# EasyEDA schematic HABSat2_schematic2302.json
TITLE: HABSat2 Schematic; REV: 1.3; Date: 2023-02-23; Sheet: 1/1; Company: Cosmo PK
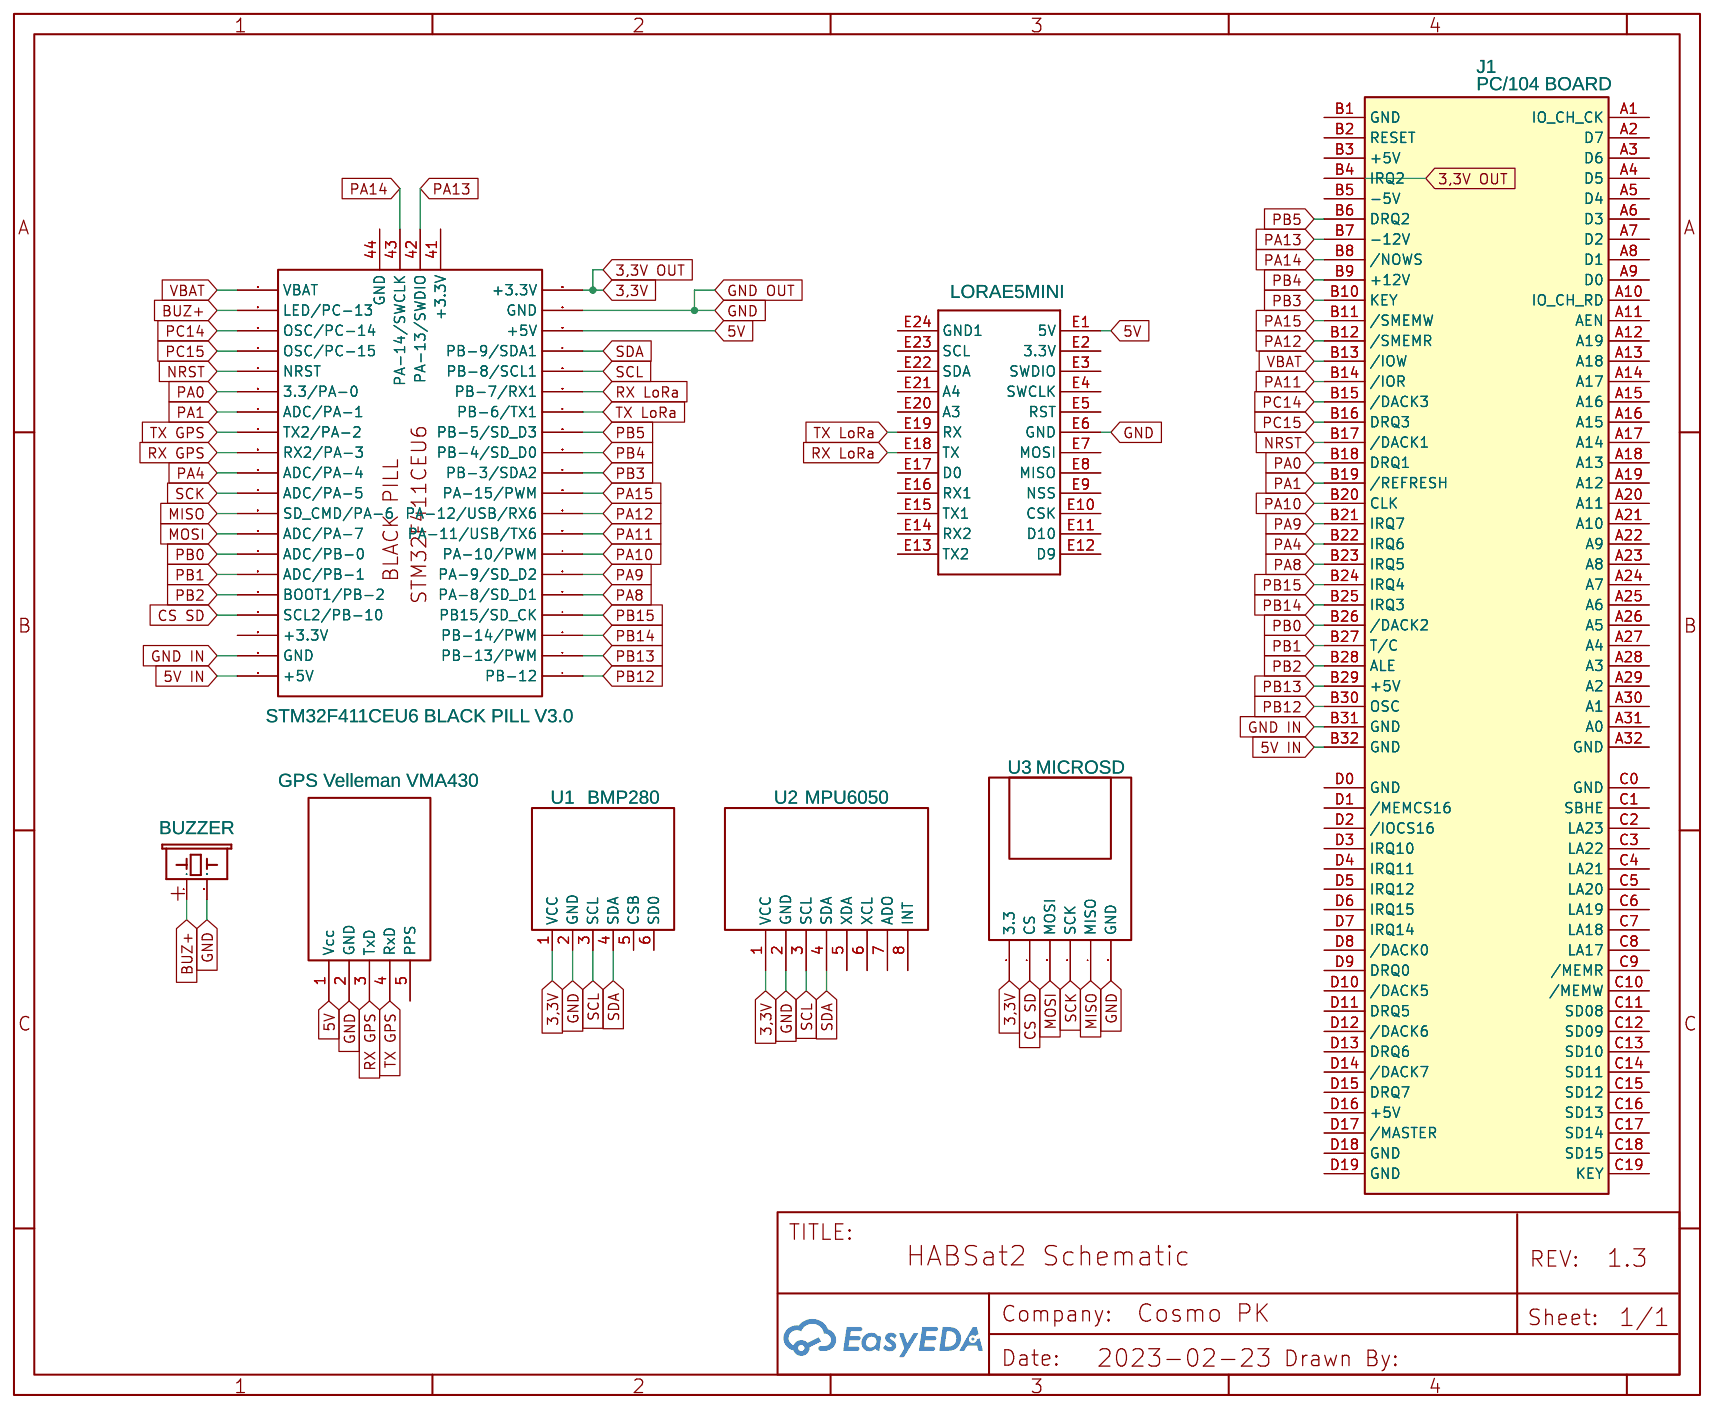
[diagram p0: schematic sheet]

## Parts
1  LORAE5MINI  [LORAE5MINI]
J1  PC/104 BOARD  [PC/104 BOARD]
SG1  BUZZER  [BUZZER-KPX-120X]
STM1  STM32F411CEU6 BLACK PILL V3.0  [STM32F411CEU6BP]
U1  BMP280  [GY-BMP280]
U2  MPU6050  [MPU6050]
U3  MICROSD  [MICROSDCARDADAPTER]
VCC  GPS Velleman VMA430  [GPS VELLEMAN VMA430]

## Library data of the parts
1 = LORAE5MINI: Contributor: Niranjoy Y
J1 = PC/104 BOARD: Contributor: andrey.shurmin
SG1 = BUZZER KX-12MM: Contributor: SparkFun; sourceId: Q1xPJ1Vd7
STM1 = STM32F411CEU6 BLACK PILL V3.0: Contributor: sulthon100399
U1 = GY-BMP280: Contributor: umitmehmet2000
U2 = MPU6050: Contributor: Bas Stoker
U3 = MICROSD: Contributor: appurva
VCC = GPS Velleman VMA430: Manufacturer: Velleman; Manufacturer Part: VMA430; Supplier: botland; Supplier Part: VMA430; link: https://botland.com.pl/moduly-gps/13032-velleman-vma430-modul-gps-glonass-u-blox-neo-7m-uart-z-antena-5410329680930.html; Contributor: szczuplak

## Nets
5V: 1.E1(5V) STM1.18(+5V) VCC.1(Vcc)
5V IN: J1.B32(GND) STM1.40(+5V)
GND: 1.E6(GND) SG1.2 STM1.19(GND) U1.2(GND) U2.2(GND) U3.6(GND) VCC.2(GND)
GND IN: J1.B31(GND) STM1.39(GND)
VBAT: J1.B13(/IOW) STM1.21(VBAT)
3,3V: J1.B4(IRQ2) STM1.20(+3.3V) U1.1(VCC) U2.1(VCC) U3.5(3.3)
BUZ+: SG1.1 STM1.22(LED/PC-13)
CS SD: STM1.37(SCL2/PB-10) U3.1(CS)
MISO: STM1.32(SD_CMD/PA-6) U3.4(MISO)
MOSI: STM1.33(ADC/PA-7) U3.3(MOSI)
NRST: J1.B17(/DACK1) STM1.25(NRST)
PA0: J1.B18(DRQ1) STM1.26(3.3/PA-0)
PA1: J1.B19(/REFRESH) STM1.27(ADC/PA-1)
PA4: J1.B22(IRQ6) STM1.30(ADC/PA-4)
PA8: J1.B23(IRQ5) STM1.5(PA-8/SD_D1)
PA9: J1.B21(IRQ7) STM1.6(PA-9/SD_D2)
PA10: J1.B20(CLK) STM1.7(PA-10/PWM)
PA11: J1.B14(/IOR) STM1.8(PA-11/USB/TX6)
PA12: J1.B12(/SMEMR) STM1.9(PA-12/USB/RX6)
PA13: J1.B7(-12V) STM1.42(PA-13/SWDIO)
PA14: J1.B8(/NOWS) STM1.43(PA-14/SWCLK)
PA15: J1.B11(/SMEMW) STM1.10(PA-15/PWM)
PB0: J1.B26(/DACK2) STM1.34(ADC/PB-0)
PB1: J1.B27(T/C) STM1.35(ADC/PB-1)
PB2: J1.B28(ALE) STM1.36(BOOT1/PB-2)
PB3: J1.B10(KEY) STM1.11(PB-3/SDA2)
PB4: J1.B9(+12V) STM1.12(PB-4/SD_D0)
PB5: J1.B6(DRQ2) STM1.13(PB-5/SD_D3)
PB12: J1.B30(OSC) STM1.1(PB-12)
PB13: J1.B29(+5V) STM1.2(PB-13/PWM)
PB14: J1.B25(IRQ3) STM1.3(PB-14/PWM)
PB15: J1.B24(IRQ4) STM1.4(PB15/SD_CK)
PC14: J1.B15(/DACK3) STM1.23(OSC/PC-14)
PC15: J1.B16(DRQ3) STM1.24(OSC/PC-15)
RX GPS: STM1.29(RX2/PA-3) VCC.3(TxD)
RX LoRa: 1.E18(TX) STM1.15(PB-7/RX1)
SCK: STM1.31(ADC/PA-5) U3.2(SCK)
SCL: STM1.16(PB-8/SCL1) U1.3(SCL) U2.3(SCL)
SDA: STM1.17(PB-9/SDA1) U1.4(SDA) U2.4(SDA)
TX GPS: STM1.28(TX2/PA-2) VCC.4(RxD)
TX LoRa: 1.E19(RX) STM1.14(PB-6/TX1)

Not connected (* = marked no-connect by the designer): 1 E2(3.3V) E3(SWDIO) E4(SWCLK) E5(RST) E7(MOSI) E8(MISO) E9(NSS) E10(CSK) E11(D10) E12(D9) E13(TX2) E14(RX2) E15(TX1) E16(RX1) E17(D0) E20(A3) E21(A4) E22(SDA) E23(SCL) E24(GND1); J1 A1(IO_CH_CK) A2(D7) A3(D6) A4(D5) A5(D4) A6(D3) A7(D2) A8(D1) A9(D0) A10(IO_CH_RD) A11(AEN) A12(A19) A13(A18) A14(A17) A15(A16) A16(A15) A17(A14) A18(A13) A19(A12) A20(A11) A21(A10) A22(A9) A23(A8) A24(A7) A25(A6) A26(A5) A27(A4) A28(A3) A29(A2) A30(A1) A31(A0) A32(GND) B1(GND) B2(RESET) B3(+5V) B5(-5V) C0(GND) C1(SBHE) C2(LA23) C3(LA22) C4(LA21) C5(LA20) C6(LA19) C7(LA18) C8(LA17) C9(/MEMR) C10(/MEMW) C11(SD08) C12(SD09) C13(SD10) C14(SD11) C15(SD12) C16(SD13) C17(SD14) C18(SD15) C19(KEY) D0(GND) D1(/MEMCS16) D2(/IOCS16) D3(IRQ10) D4(IRQ11) D5(IRQ12) D6(IRQ15) D7(IRQ14) D8(/DACK0) D9(DRQ0) D10(/DACK5) D11(DRQ5) D12(/DACK6) D13(DRQ6) D14(/DACK7) D15(DRQ7) D16(+5V) D17(/MASTER) D18(GND) D19(GND); STM1 38(+3.3V) 41(+3.3V) 44(GND); U1 5(CSB) 6(SD0); U2 5(XDA) 6(XCL) 7(ADO) 8(INT); VCC 5(PPS)
